# Altium schematic sheet BaseBoard.SchDoc
size A4
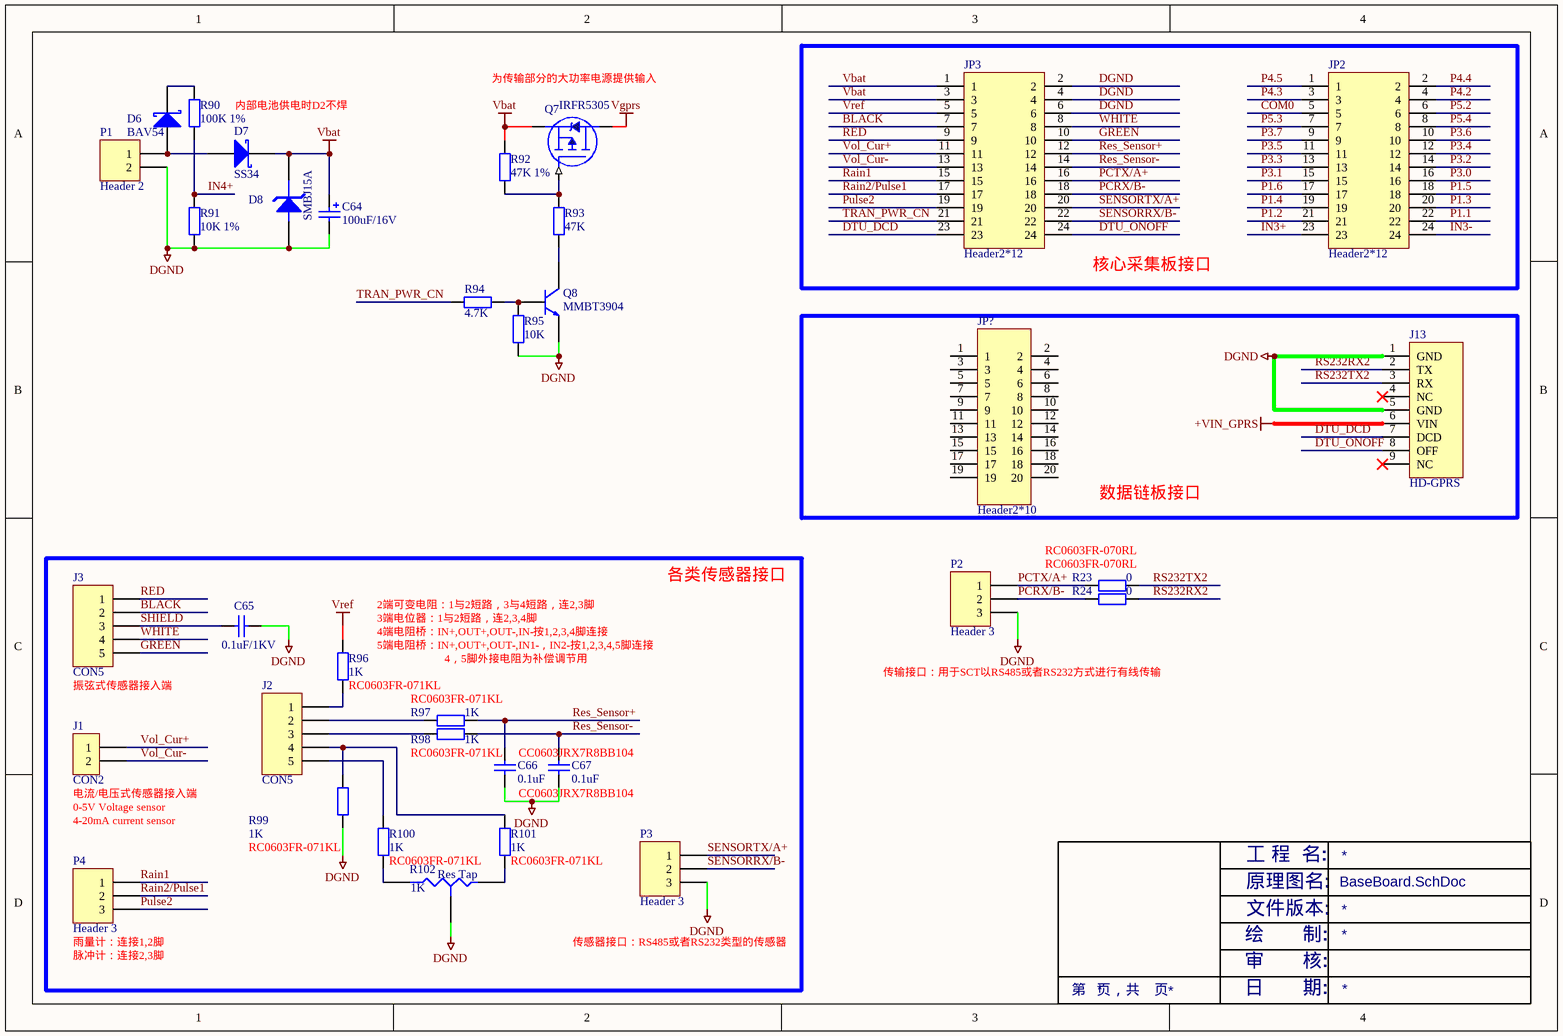
[diagram p0: BaseBoard.SchDoc]

## Parts
C64  100uF/16V  [CD7343]
C65  0.1uF/1KV  [CC1206]
C66  0.1uF  Type No.: CC0603JRX7R8BB104  [CC0603]
C67  0.1uF  Type No.: CC0603JRX7R8BB104  [CC0603]
D6  BAV54  [SOD323]
D7  SS34  [SSMB]
D8  SMBJ15A  [SSMB]
J1  CON2  [ECH350H-2P]
J2  CON5  [ECH350H-5P]
J3  CON5  [ECH350H-5P]
J13  HD-GPRS  [CON9-2.54MM]
JP2  Header2*12  [IDC24-2.0MM-INSERT]
JP3  Header2*12  [IDC24-2.0MM-INSERT]
JP?  Header2*10  [IDC20-2.0MM]
P1  Header 2  [HDR1X2]
P2  Header 3  [HDR1X3]
P3  Header 3  [HDR1X3]
P4  Header 3  [HDR1X3]
Q7  IRFR5305  [D-PAK]
Q8  MMBT3904  [SOT-23W]
R23  0  Type No.: RC0603FR-070RL  [CC0603]
R24  0  Type No.: RC0603FR-070RL  [CC0603]
R90  100K 1%  [CC0603]
R91  10K 1%  [CC0603]
R92  47K 1%  [CC0603]
R93  47K  [CC0603]
R94  4.7K  [CC0603]
R95  10K  [CC0603]
R96  1K  Type No.: RC0603FR-071KL  [CC0603]
R97  1K  Type No.: RC0603FR-071KL  [CC0603]
R98  1K  Type No.: RC0603FR-071KL  [CC0603]
R99  1K  Type No.: RC0603FR-071KL  [CC0603]
R100  1K  Type No.: RC0603FR-071KL  [CC0603]
R101  1K  Type No.: RC0603FR-071KL  [CC0603]
R102  Res Tap  value 1K  [VR3]

## Blocks framed on the sheet
核心采集板接口: JP2 JP3
数据链板接口: J13 JP?
各类传感器接口: C65-C67 J1-J3 P3 P4 R96-R102

## Nets
+VIN_GPRS: J13.6(VIN)
DGND: C64.2 C65.1 C66.2 C67.2 D8.1(A) J13.1(GND) J13.5(GND) JP3.2 JP3.4 JP3.6 P1.2 P2.3 P3.3 Q8.2 R91.2 R95.2 R99.1 R102.3(TAP)
Vbat: C64.1 D7.2(K) D8.2(K) JP3.1 JP3.3 Q7.3(SOURCE) R92.1
Vgprs: Q7.2(DRAIN)
Vref: JP3.5 R96.2
BLACK: J3.2 JP3.7
COM0: JP2.5
DTU_DCD: J13.7(DCD) JP3.23
DTU_ONOFF: J13.8(OFF) JP3.24
GREEN: J3.5 JP3.10
IN3+: JP2.23
IN3-: JP2.24
IN4+: R90.1 R91.1
P1.1: JP2.22
P1.2: JP2.21
P1.3: JP2.20
P1.4: JP2.19
P1.5: JP2.18
P1.6: JP2.17
P3.0: JP2.16
P3.1: JP2.15
P3.2: JP2.14
P3.3: JP2.13
P3.4: JP2.12
P3.5: JP2.11
P3.6: JP2.10
P3.7: JP2.9
P4.2: JP2.4
P4.3: JP2.3
P4.4: JP2.2
P4.5: JP2.1
P5.2: JP2.6
P5.3: JP2.7
P5.4: JP2.8
PCRX/B-: JP3.18 P2.2 R24.2
PCTX/A+: JP3.16 P2.1 R23.2
Pulse2: JP3.19 P4.3
Rain1: JP3.15 P4.1
Rain2/Pulse1: JP3.17 P4.2
RED: J3.1 JP3.9
Res_Sensor+: C66.1 JP3.12 R97.1
Res_Sensor-: C67.1 JP3.14 R98.1
RS232RX2: J13.2(TX) R24.1
RS232TX2: J13.3(RX) R23.1
SENSORRX/B-: JP3.22 P3.2
SENSORTX/A+: JP3.20 P3.1
SHIELD: C65.2 J3.3
TRAN_PWR_CN: JP3.21 R94.1
Vol_Cur+: J1.1 JP3.11
Vol_Cur-: J1.2 JP3.13
WHITE: J3.4 JP3.8
NetD6_1: D6.1(A) D7.1(A) P1.1
NetD6_2: D6.2(K) R90.2
NetJ2_1: J2.1 R96.1
NetJ2_2: J2.2 R97.2
NetJ2_3: J2.3 R98.2
NetJ2_4: J2.4 R99.2 R101.2
NetJ2_5: J2.5 R100.2
NetQ7_1: Q7.1(GATE) R92.2 R93.1
NetQ8_1: Q8.1 R94.2 R95.1
NetQ8_3: Q8.3 R93.2
NetR100_1: R100.1 R102.2(B)
NetR101_1: R101.1 R102.1(A)

Not connected (* = marked no-connect by the designer): J13 4(NC)* 9(NC)*; JP? 1 2 3 4 5 6 7 8 9 10 11 12 13 14 15 16 17 18 19 20

## Notes on the sheet
- 内部电池供电时D2不焊
- (near Q7) 为传输部分的大功率电源提供输入
- (near R96) 2端可变电阻：1与2短路，3与4短路，连2,3脚
- (near R96) 3端电位器：1与2短路，连2,3,4脚
- (near R96) 4端电阻桥：IN+,OUT+,OUT-,IN-按1,2,3,4脚连接
- (near R96) 5端电阻桥：IN+,OUT+,OUT-,IN1-，IN2-按1,2,3,4,5脚连接
- (near J3) 振弦式传感器接入端
- 4，5脚外接电阻为补偿调节用
- 传输接口：用于SCT以RS485或者RS232方式进行有线传输
- (near J1) 电流/电压式传感器接入端
- (near J1) 0-5V Voltage sensor
- 4-20mA current sensor
- (near P4) 雨量计：连接1,2脚
- (near P4) 脉冲计：连接2,3脚
- 传感器接口：RS485或者RS232类型的传感器
- 文件版本:
- 原理图名:
- 工 程  名:
- 绘       制:
- 审       核:
- 第   页，共    页
- 日       期:

## Library data of the parts
C64 = Cap Pol2: Polarized Capacitor (Axial); Value: 100pF; Published: 8-Jun-2000; LatestRevisionDate: 17-Jul-2002; LatestRevisionNote: Re-released for DXP Platform.; PackageReference: POLAR0.8; Publisher: Altium Limited; PackageDescription: Polarized Capacitor; 2 Leads
C65 = Cap: Capacitor; Value: 0.1uF; Published: 8-Jun-2000; LatestRevisionDate: 17-Jul-2002; LatestRevisionNote: Re-released for DXP Platform.; PackageReference: RAD-0.3; Publisher: Altium Limited; PackageDescription: Radial Cap, Thru-Hole; 2 Leads; 0.3 in Pin Spacing
C66 C67 = Cap: Capacitor
D6 D7 = D Schottky: Schottky Diode; Published: 8-Jun-2000; LatestRevisionDate: 17-Jul-2002; LatestRevisionNote: Re-released for DXP Platform.; PackageReference: SMB; Publisher: Altium Limited; PackageDescription: DO-214-AA/SMB; 2 C-Bend Leads; Body 5.3 x 3.6 mm, inc. leads (LxW); Code_JEDEC: DO-214-AA
D8 = DIODE ZENER
J1 = SIP2: jointbar
J2 J3 = Header 5: Header, 5-Pin; LatestRevisionDate: 17-Jul-2002; LatestRevisionNote: Re-released for DXP Platform.; Publisher: Altium Limited
J13 = HD-DB9
P1 = Header 2: Header, 2-Pin; LatestRevisionDate: 17-Jul-2002; LatestRevisionNote: Re-released for DXP Platform.; Publisher: Altium Limited
P2-P4 = Header 3: Header, 3-Pin; LatestRevisionDate: 17-Jul-2002; LatestRevisionNote: Re-released for DXP Platform.; Publisher: Altium Limited
Q7 = P-MOSFET
Q8 = NPN
R23 R24 R90 R91 R95-R101 = Res2: Resistor
  R90: Published: 8-Jun-2000; LatestRevisionDate: 17-Jul-2002; LatestRevisionNote: Re-released for DXP Platform.; PackageReference: AXIAL-0.4; Publisher: Altium Limited; PackageDescription: Axial Device, Thru-Hole; 2 Leads; 0.4 in Pin Spacing; Value: 100K
  R91 R95: Published: 8-Jun-2000; LatestRevisionDate: 17-Jul-2002; LatestRevisionNote: Re-released for DXP Platform.; PackageReference: AXIAL-0.4; Publisher: Altium Limited; PackageDescription: Axial Device, Thru-Hole; 2 Leads; 0.4 in Pin Spacing; Value: 10K
R92-R94 = Res2: Resistor; Value: 10K; Published: 8-Jun-2000; LatestRevisionDate: 17-Jul-2002; LatestRevisionNote: Re-released for DXP Platform.; PackageReference: AXIAL-0.4; Publisher: Altium Limited; PackageDescription: Axial Device, Thru-Hole; 2 Leads; 0.4 in Pin Spacing
R102 = Res Tap: Tapped Resistor; Sim Note: Enter the Resistance value and the set point into parameter fields.; Set Position: 0.5; Published: 24-Mar-1999; LatestRevisionDate: 17-Jul-2002; LatestRevisionNote: Re-released for DXP Platform.; PackageReference: VR3; Publisher: Altium Limited; PackageDescription: Variable Resistor, Thru-Hole; 3 Leads